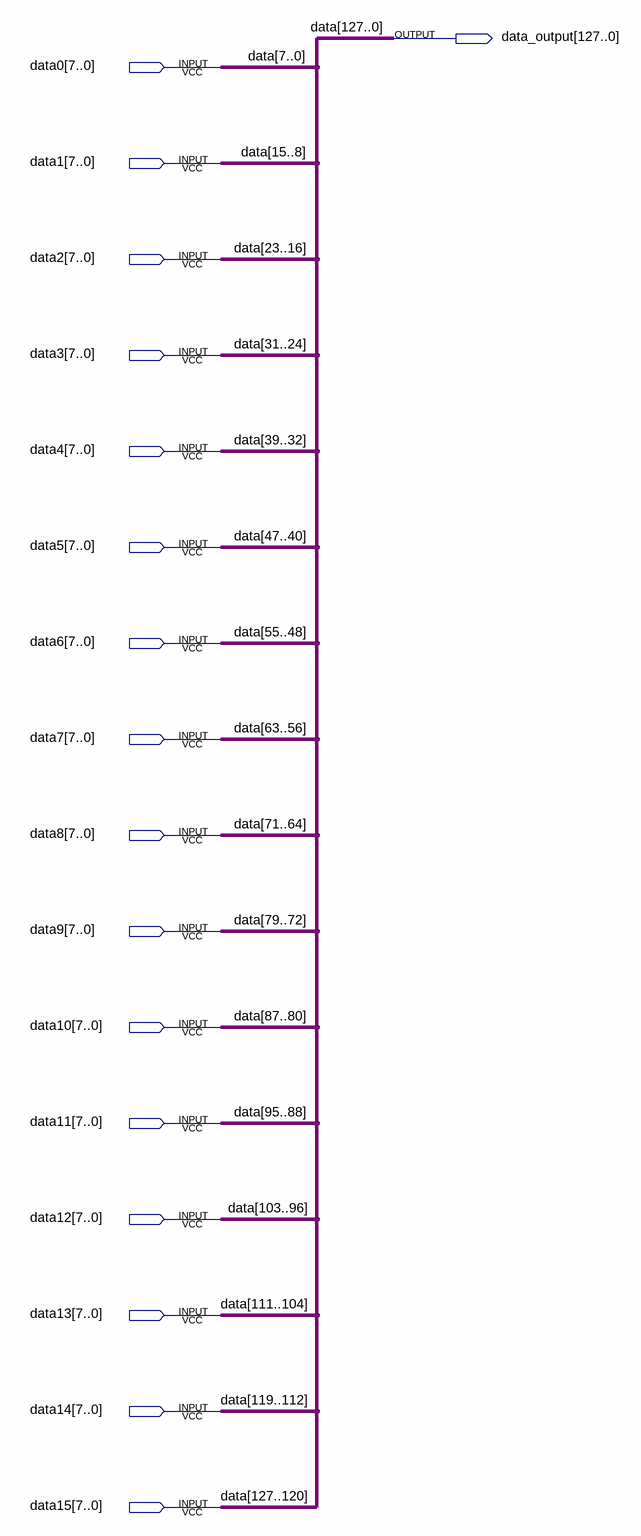
[diagram p0: schematic sheet]
// Quartus schematic 16to128.bdf as structural Verilog: 0 symbols, 17 pins
module \16to128  (
  input  [7:0] data0,
  input  [7:0] data1,
  input  [7:0] data2,
  input  [7:0] data3,
  input  [7:0] data4,
  input  [7:0] data5,
  input  [7:0] data6,
  input  [7:0] data7,
  input  [7:0] data8,
  input  [7:0] data9,
  input  [7:0] data10,
  input  [7:0] data11,
  input  [7:0] data12,
  input  [7:0] data13,
  input  [7:0] data14,
  input  [7:0] data15,
  output [127:0] data_output
);


  assign data_output = {data15, data14, data13, data12, data11, data10, data9, data8, data7, data6, data5, data4, data3, data2, data1, data0};

  // Other names for the same wires on the sheet: data[127:0] = {data15, data14, data13, data12, data11, data10, data9, data8, data7, data6, data5, data4, data3, data2, data1, data0}
endmodule
